# EAGLE design Blinds Motor ESP32 (EAGLE 9.6.2)
AUTHOR: E. Anderson; REV: 1
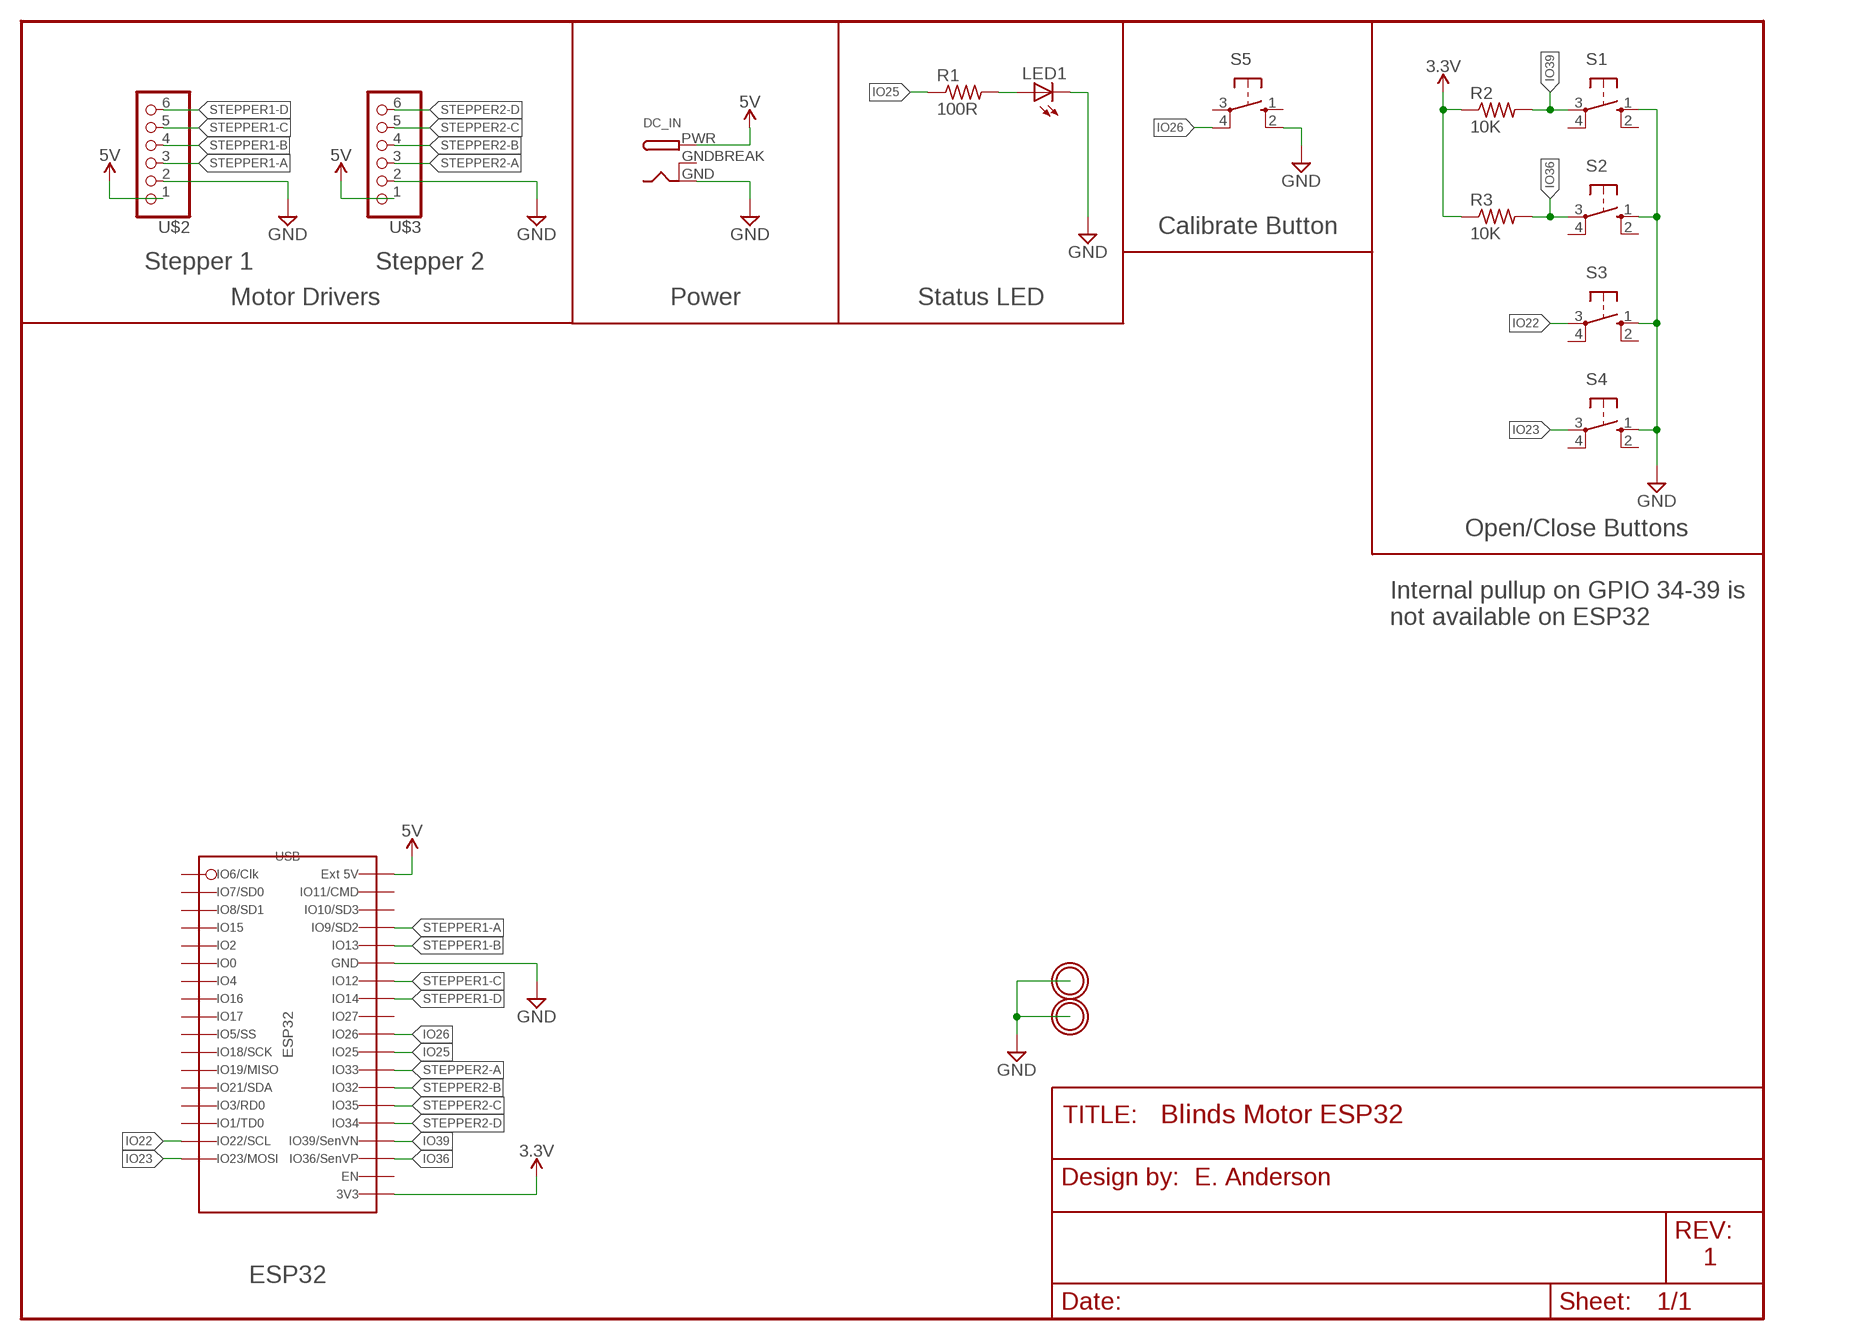
[diagram p0: schematic, sheet 1]

## Parts
DC_IN  DCBARRELPTH  [DCJACK_2MM_PTH]
LED1  LED-CHIPLED_1206_LONG  [CHIPLED_1206_LONG]
R1  100R  R_USR1206  [R1206]
R2  10K  R_USR1206  [R1206]
R3  10K  R_USR1206  [R1206]
S1  B3F-10XX  [B3F-10XX]
S2  B3F-10XX  [B3F-10XX]
S3  B3F-10XX  [B3F-10XX]
S4  B3F-10XX  [B3F-10XX]
S5  B3F-10XX  [B3F-10XX]
U$2  Stepper 1  1X6_HEADER_LONG  [1X06]
U$3  Stepper 2  1X6_HEADER_LONG  [1X06]
U$5  MICROBUILDER_MOUNTINGHOLE3.0THIN  [MICROBUILDER_MOUNTINGHOLE_3.0_PLATEDTHIN]
U$6  MICROBUILDER_MOUNTINGHOLE3.0THIN  [MICROBUILDER_MOUNTINGHOLE_3.0_PLATEDTHIN]
U$7  ESP32-DEV  [ESP32_DEV]

## Nets
3.3V: R2.1 R3.1 U$7.3V3
5V: DC_IN.PWR U$2.1 U$3.1 U$7.5V(EXT_5V)
GND: DC_IN.GND LED1.C S1.1(S) S2.1(S) S3.1(S) S4.1(S) S5.2(S1) U$2.2 U$3.2 U$7.GND1 U$7.GND2(GND1) U$7.GND(GND1)
IO22: S3.3(P) U$7.IO22
IO23: S4.3(P) U$7.IO23(IO23/SCL)
IO25: R1.1 U$7.IO25
IO26: S5.4(P1) U$7.IO26
IO36: R3.2 S2.3(P) U$7.IO36-SVP(IO36/SVP)
IO39: R2.2 S1.3(P) U$7.IO39-SVN(IO39/SVN)
N$1: LED1.A R1.2
STEPPER1-A: U$2.3 U$7.IO9-SD2(IO9/SD2)
STEPPER1-B: U$2.4 U$7.IO13
STEPPER1-C: U$2.5 U$7.IO12
STEPPER1-D: U$2.6 U$7.IO14
STEPPER2-A: U$3.3 U$7.IO33
STEPPER2-B: U$3.4 U$7.IO32
STEPPER2-C: U$3.5 U$7.IO35
STEPPER2-D: U$3.6 U$7.IO34
Unconnected: S1.2(S1) S1.4(P1) S2.2(S1) S2.4(P1) S3.2(S1) S3.4(P1) S4.2(S1) S4.4(P1) S5.1(S) S5.3(P) U$7.EN U$7.IO0 U$7.IO1-TXD0(TXD0) U$7.IO2 U$7.IO3-RXD0(RXD0) U$7.IO4 U$7.IO5 U$7.IO6-CLK(CLK) U$7.IO7-SD0(SD0) U$7.IO8-SD1(SD1) U$7.IO10-SD3(IO10/SD3) U$7.IO11-CMD(IO11/CMD) U$7.IO15 U$7.IO16 U$7.IO17 U$7.IO18 U$7.IO19 U$7.IO21(IO21/SDA) U$7.IO27

## Notes on the sheet
- Calibrate Button
- Stepper 1 | Stepper 2
- Motor Drivers | Power | Status LED
- Open/Close Buttons
- Internal pullup on GPIO 34-39 is
  not available on ESP32
- ESP32

## Power pins joined to a net without a drawn wire
GNDBREAK: DC_IN.GNDBREAK

## Library data of the parts
DC_IN = connectors:DCBARREL: 2.0mm DC Barrel Jack DCJACK_2MM_PTH - Through Hole Jack (4UConnector: 05537)
LED1 = Transistors MOSFETs:LED: LED White LED 0.1" pitch
R1-R3 = passives:R_US: Resistor 7mm pin spacing
S1-S5 = buttons:B3F-10XX: OMRON SWITCH; MPN: B3F-1000; OC_FARNELL: 176432; OC_NEWARK: 36M3542
U$2 U$3 = connectors:1X6_HEADER: 1x6 Pin Header w/ 0.1" spacing. Octagonal pads
U$5 U$6 = connectors:MICROBUILDER_MOUNTINGHOLE: Mounting Hole For #2 screws (0.086"/2.18mm width, 0.094"/2.4mm hole) use 2.5mm; BOM: EXCLUDE
U$7 = connectors:ESP32: ESP-32-Dev ESP32 from Inland/Microcenter

## Board
Blinds motor driver board for ESP32 Board for connecting ESP32 to stepper drivers. Uses ESP32-Dev board or the Inland clone sold at Microcenter. Could be modified to use other ESP32 based developer boards, but code would need to be modified to use different pinouts. Uses Keyestudio Stepper ULN2003 based driver
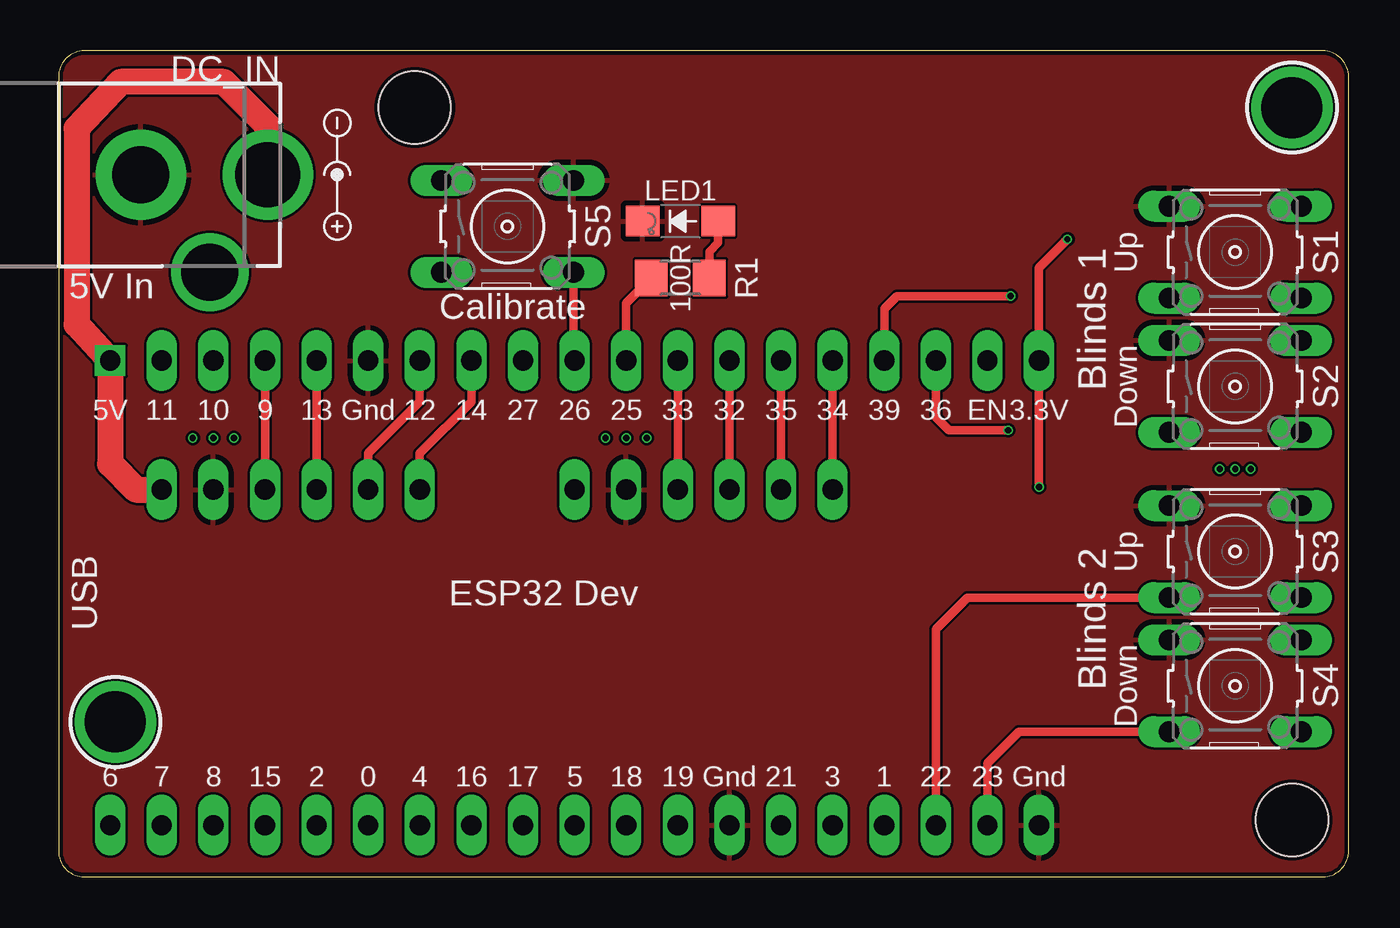
[diagram p1: board, top side]
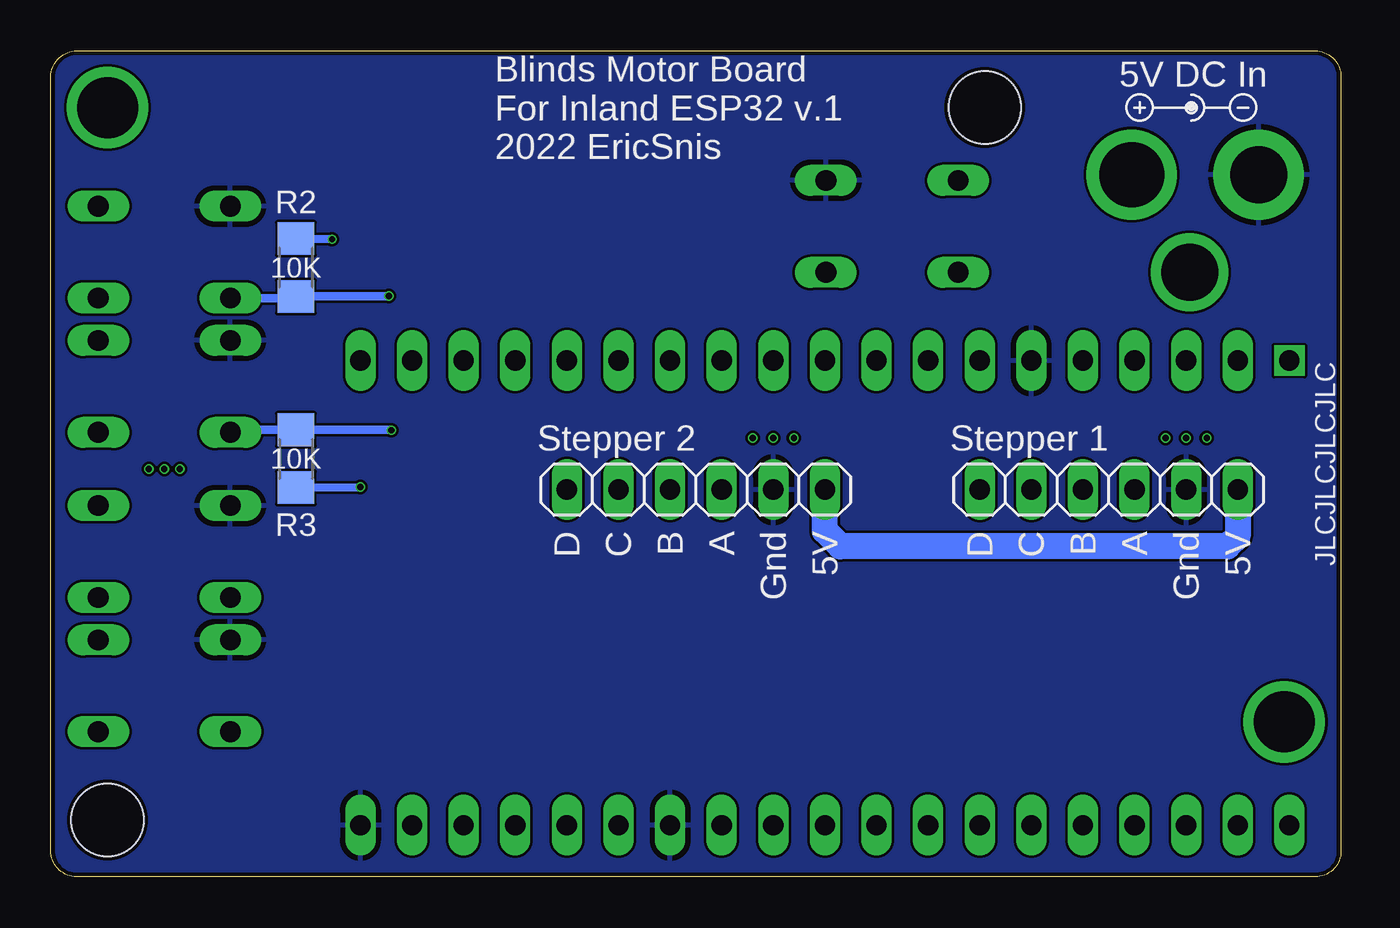
[diagram p2: board, bottom side, seen from below]

Size 63.5 x 40.64 mm. Coordinates in mm from the lower left corner, seen from the top.
Outline: 1.27,0 62.23,0 arc90 63.5,1.27 63.5,39.37 arc90 62.23,40.64 1.27,40.64 arc90 0,39.37 0,1.27 arc90 1.27,0
Copper layers (1*16): Top 0.035559375mm / dielectric 1.6mm / Bottom 0.035559375mm
Design rules "default": minimum track width 5mil, minimum drill 12mil, track to track 5mil, track to pad 5mil, pad to pad 5mil, via to via 5mil, smd to smd 5mil, copper to edge 8mil, drill to drill 6mil, minimum pad ring 5mil, minimum via ring 3mil, stop-mask expansion 2.5mil, vias tented up to drill 0mil, thermal gap 10mil
Holes 3.56 mm at 60.71,2.79 17.53,37.85

### Footprints (pad centres in the part's own frame; a part is rotated, then mirrored left to right if it is on the bottom)
DCJACK_2MM_PTH = drill 2.8 pad 4.445: GND 0,7.35 | drill 2.8: GNDBREAK 4.8,10.75 | drill 3.2 pad 4.445: PWR 0,13.6
CHIPLED_1206_LONG = smd 1.5 x 1.651: A 0,-1.854; C 0,1.854
R1206 = smd 1.6 x 1.803: 1 -1.422,0; 2 1.422,0
B3F-10XX = drill 1.016 long: 1 -3.251,2.261; 2 3.251,2.261; 3 -3.251,-2.261; 4 3.251,-2.261
1X06 = drill 1 long: 1 -6.35,0; 2 -3.81,0; 3 -1.27,0; 4 1.27,0; 5 3.81,0; 6 6.35,0
MICROBUILDER_MOUNTINGHOLE_3.0_PLATEDTHIN = drill 3 pad 3.6: P$1 0,0
ESP32_DEV = drill 1 long: 3V3 11.43,-22.86; EN 11.43,-20.32; GND 11.43,10.16; GND1 -11.43,-22.86; GND2 -11.43,-7.62; IO0 -11.43,10.16; IO1-TXD0 -11.43,-15.24; IO2 -11.43,12.7; IO3-RXD0 -11.43,-12.7; IO4 -11.43,7.62; IO5 -11.43,0; IO6-CLK -11.43,22.86; IO7-SD0 -11.43,20.32; IO8-SD1 -11.43,17.78; IO9-SD2 11.43,15.24; IO10-SD3 11.43,17.78; IO11-CMD 11.43,20.32; IO12 11.43,7.62; IO13 11.43,12.7; IO14 11.43,5.08; IO15 -11.43,15.24; IO16 -11.43,5.08; IO17 -11.43,2.54; IO18 -11.43,-2.54; IO19 -11.43,-5.08; IO21 -11.43,-10.16; IO22 -11.43,-17.78; IO23 -11.43,-20.32; IO25 11.43,-2.54; IO26 11.43,0; IO27 11.43,2.54; IO32 11.43,-7.62; IO33 11.43,-5.08; IO34 11.43,-12.7; IO35 11.43,-10.16; IO36-SVP 11.43,-17.78; IO39-SVN 11.43,-15.24 | drill 1 square: 5V 11.43,22.86

### Placement (x,y rotation side)
DC_IN  -3.3,34.54 270 top
LED1  30.61,32.26 90 top
R1  30.61,29.46 0 top
R2  51.44,29.97 270 bottom
R3  51.44,20.57 90 bottom
S1  57.91,30.73 0 top
S2  57.91,24.13 0 top
S3  57.91,16 0 top
S4  57.91,9.4 0 top
S5  22.1,32 0 top
U$2  11.43,19.05 180 bottom
U$3  31.75,19.05 180 bottom
U$4  [CENTER-POS-SMALL]  13.72,34.54 90 top
U$5  2.79,7.62 0 top
U$6  60.71,37.85 0 top
U$7  25.4,13.97 90 top
U$8  [CENTER-POS-SMALL]  7.37,37.85 0 bottom

### Tracks (layer width: path | path; a pad name or v marks a point on that pad's centre or on a via)
3.3V  (via drill 0.3)
  Top 0.406: v48.26,19.18 U$7.3V3 48.26,29.97 v49.66,31.37
  Bottom 0.406: R2.1 v49.66,31.37 | R3.1 v48.26,19.18
5V
  Top 1.27: DC_IN.PWR 10.3,36.95 8.13,39.12 3.05,39.12 0.89,36.83 0.89,27.18 U$7.5V 2.54,20.32 3.81,19.05 U$2.1
  Bottom 1.27: U$2.1 5.08,16.76 5.59,16.26 24.64,16.26 25.4,17.02 U$3.1
GND
  pour Top (isolate 0.001): 1.27,0 62.23,0 arc90 63.5,1.27 63.5,39.37 arc90 62.23,40.64 1.27,40.64 arc90 0,39.37 0,1.27 arc90
  pour Bottom (isolate 0.001): 1.27,0 62.23,0 arc90 63.5,1.27 63.5,39.37 arc90 62.23,40.64 1.27,40.64 arc90 0,39.37 0,1.27 arc90
IO22
  Top 0.406: S3.3 44.73,13.74 43.18,12.19 U$7.IO22
IO23
  Top 0.406: S4.3 47.27,7.14 45.72,5.59 U$7.IO23
IO25
  Top 0.406: U$7.IO25 27.94,28.22 R1.1
IO26
  Top 0.406: U$7.IO26 25.35,25.45 S5.4
IO36  (via drill 0.3)
  Top 0.406: v46.74,21.97 43.81,21.97 43.18,22.61 U$7.IO36-SVP
  Bottom 0.406: S2.3 54.53,22 R3.2 46.76,22 v46.74,21.97
IO39  (via drill 0.3)
  Top 0.406: U$7.IO39-SVN 40.64,27.94 41.27,28.57 v46.86,28.57
  Bottom 0.406: S1.3 51.51,28.47 R2.2 51.41,28.57 v46.86,28.57
N$1
  Top 0.406: R1.2 32.03,30.76 32.46,31.19 LED1.A
N$2  (via drill 0.3)
  other vias: 8.64,21.59
N$3  (via drill 0.3)
  other vias: 7.62,21.59
N$4  (via drill 0.3)
  other vias: 6.6,21.59
N$5  (via drill 0.3)
  other vias: 27.94,21.59
N$6  (via drill 0.3)
  other vias: 28.96,21.59
N$7  (via drill 0.3)
  other vias: 26.92,21.59
N$8  (via drill 0.3)
  other vias: 57.91,20.07
N$9  (via drill 0.3)
  other vias: 57.15,20.07
N$10  (via drill 0.3)
  other vias: 58.67,20.07
STEPPER1-A
  Top 0.406: U$2.3 U$7.IO9-SD2
STEPPER1-B
  Top 0.406: U$2.4 U$7.IO13
STEPPER1-C
  Top 0.406: U$2.5 15.24,20.83 17.78,23.37 U$7.IO12
STEPPER1-D
  Top 0.406: U$2.6 17.78,20.83 20.32,23.37 U$7.IO14
STEPPER2-A
  Top 0.406: U$3.3 U$7.IO33
STEPPER2-B
  Top 0.406: U$3.4 U$7.IO32
STEPPER2-C
  Top 0.406: U$3.5 U$7.IO35
STEPPER2-D
  Top 0.406: U$3.6 U$7.IO34

### Text on the board
tPlace: Up | 5V In | Calibrate | Blinds 1 | Down | Up | USB | ESP32 Dev | Blinds 2 | Down
bPlace: 5V DC In | Blinds Motor Board / For Inland ESP32 v.1 / 2022 EricSnis | JLCJLCJLCJLC | 5V | Gnd | A | B | C | D | 5V | Gnd | A | B | C | D